# EAGLE design untitled (EAGLE 9.6.2)
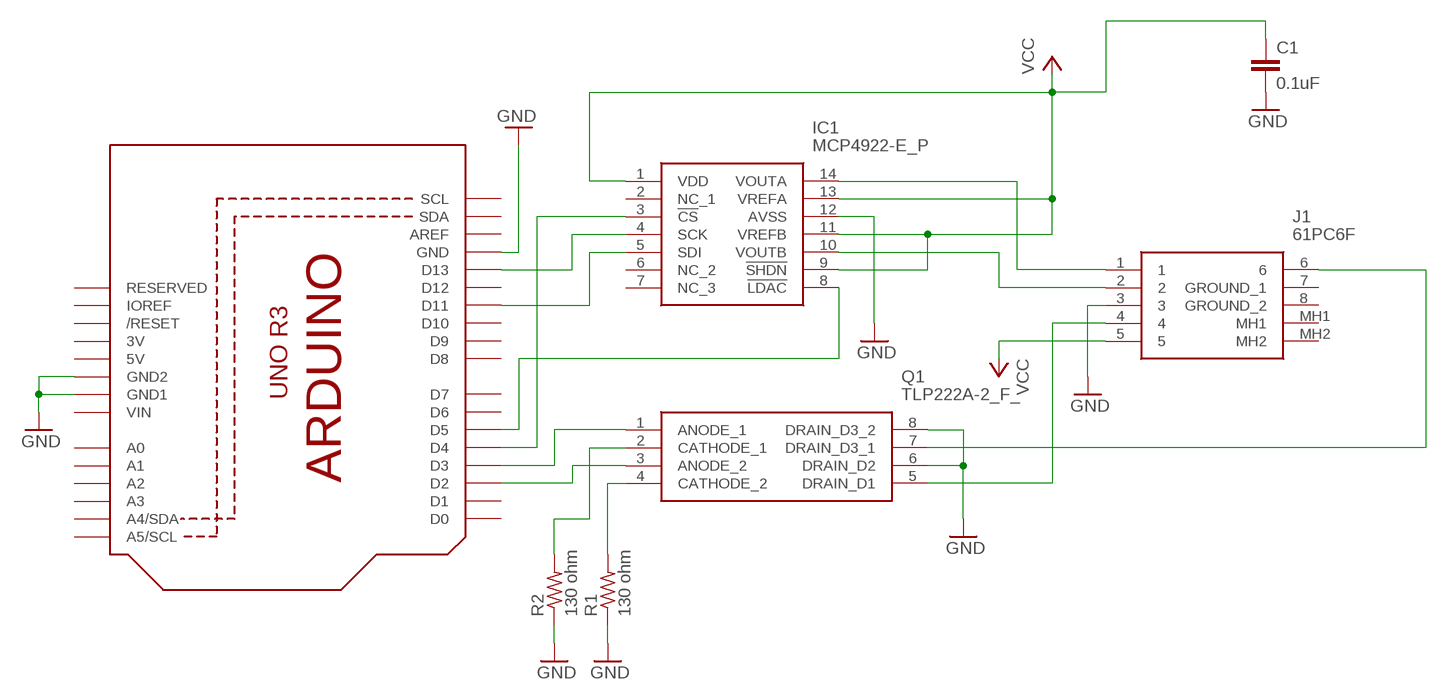
[diagram p0: schematic, sheet 1]

## Parts
C1  0.1uF  C-EU050-024X044  [C050-024X044]
IC1  MCP4922-E_P  [DIP794W56P254L1905H432Q14N]
J1  61PC6F  [61PC6F]
Q1  TLP222A-2_F_  [DIP762W60P254L966H485Q8N]
R1  130 ohm  R-US_0207/7  [0207/7]
R2  130 ohm  R-US_0207/7  [0207/7]
U1  ARDUINOR3-BPLACE  [ARDUINOR3-BPLACE]

## Nets
GND: C1.2 IC1.12(AVSS) J1.3 Q1.6(DRAIN_D2) Q1.8(DRAIN_D3_2) R1.1 R2.1 U1.GND U1.GND1 U1.GND2
N$1: IC1.4(SCK) U1.D13
N$2: IC1.5(SDI) U1.D11
N$3: Q1.4(CATHODE_2) R1.2
N$4: IC1.3(!CS) U1.D4
N$5: IC1.8(!LDAC) U1.D5
N$6: Q1.2(CATHODE_1) R2.2
N$7: Q1.1(ANODE_1) U1.D3
N$8: Q1.3(ANODE_2) U1.D2
N$10: J1.6 Q1.7(DRAIN_D3_1)
N$11: J1.4 Q1.5(DRAIN_D1)
N$12: IC1.14(VOUTA) J1.1
N$14: IC1.10(VOUTB) J1.2
VCC: C1.1 IC1.1(VDD) IC1.9(!SHDN) IC1.11(VREFB) IC1.13(VREFA) J1.5
Unconnected: IC1.2(NC_1) IC1.6(NC_2) IC1.7(NC_3) J1.7(GROUND_1) J1.8(GROUND_2) J1.MH1 J1.MH2 U1.A0 U1.A1 U1.A2 U1.A3 U1.A4(A4/SDA) U1.A5(A5/SCL) U1.AREF U1.D0 U1.D1 U1.D6 U1.D7 U1.D8 U1.D9 U1.D10 U1.D12 U1.IOREF U1.RESERVED U1.RESET(/RESET) U1.SCL U1.SDA

## Power pins joined to a net without a drawn wire
3V: U1.3V
5V: U1.5V
VIN: U1.VIN

## Library data of the parts
C1 = rcl:C-EU: CAPACITOR, European symbol; SPICEPREFIX: C
IC1 = SamacSys_Parts:MCP4922-E_P: Microchip MCP4922-E/P, 2-channel 12 bit Serial DAC, 14-Pin PDIP Source: Datasheet <https://componentsearchengine.com/Datasheets/1/MCP4922-E_P.pdf>; DESCRIPTION: Microchip MCP4922-E/P, 2-channel 12 bit Serial DAC, 14-Pin PDIP; HEIGHT: 4.32mm; MANUFACTURER_NAME: Microchip; MANUFACTURER_PART_NUMBER: MCP4922-E/P; MOUSER_PART_NUMBER: 579-MCP4922-E/P; MOUSER_PRICE-STOCK: https://www.mouser.com/Search/Refine.aspx?Keyword=579-MCP4922-E%2FP
J1 = SamacSys_Parts:61PC6F: Conn Circular DIN F 6 POS Solder RA Thru-Hole 6 Terminal 1 Port Source: Datasheet <https://componentsearchengine.com/Datasheets/1/61PC6F.pdf>; DESCRIPTION: Conn Circular DIN F 6 POS Solder RA Thru-Hole 6 Terminal 1 Port; HEIGHT: 21mm; MANUFACTURER_NAME: Switchcraft; MANUFACTURER_PART_NUMBER: 61PC6F; MOUSER_PART_NUMBER: 502-61PC6F; MOUSER_PRICE-STOCK: https://www.mouser.com/Search/Refine.aspx?Keyword=502-61PC6F
Q1 = SamacSys_Parts:TLP222A-2_F_: MOSFET Output Optocouplers Photorelay Voff=60V Ion=0.5/0.4A dual Source: Datasheet <https://componentsearchengine.com/Datasheets/1/TLP222A-2(F).pdf>; DESCRIPTION: MOSFET Output Optocouplers Photorelay Voff=60V Ion=0.5/0.4A dual; HEIGHT: 4.85mm; MANUFACTURER_NAME: Toshiba; MANUFACTURER_PART_NUMBER: TLP222A-2(F); MOUSER_PART_NUMBER: 757-TLP222A-2(F); MOUSER_PRICE-STOCK: https://www.mouser.com/Search/Refine.aspx?Keyword=757-TLP222A-2%28F%29
R1 R2 = adafruit:R-US_: RESISTOR, American symbol
U1 = adafruit:ARDUINOR3: This is a new object for the new Arduino R3 - with extra pins that you may want to use (such as IOref, and duplicated A4/A5

## Board
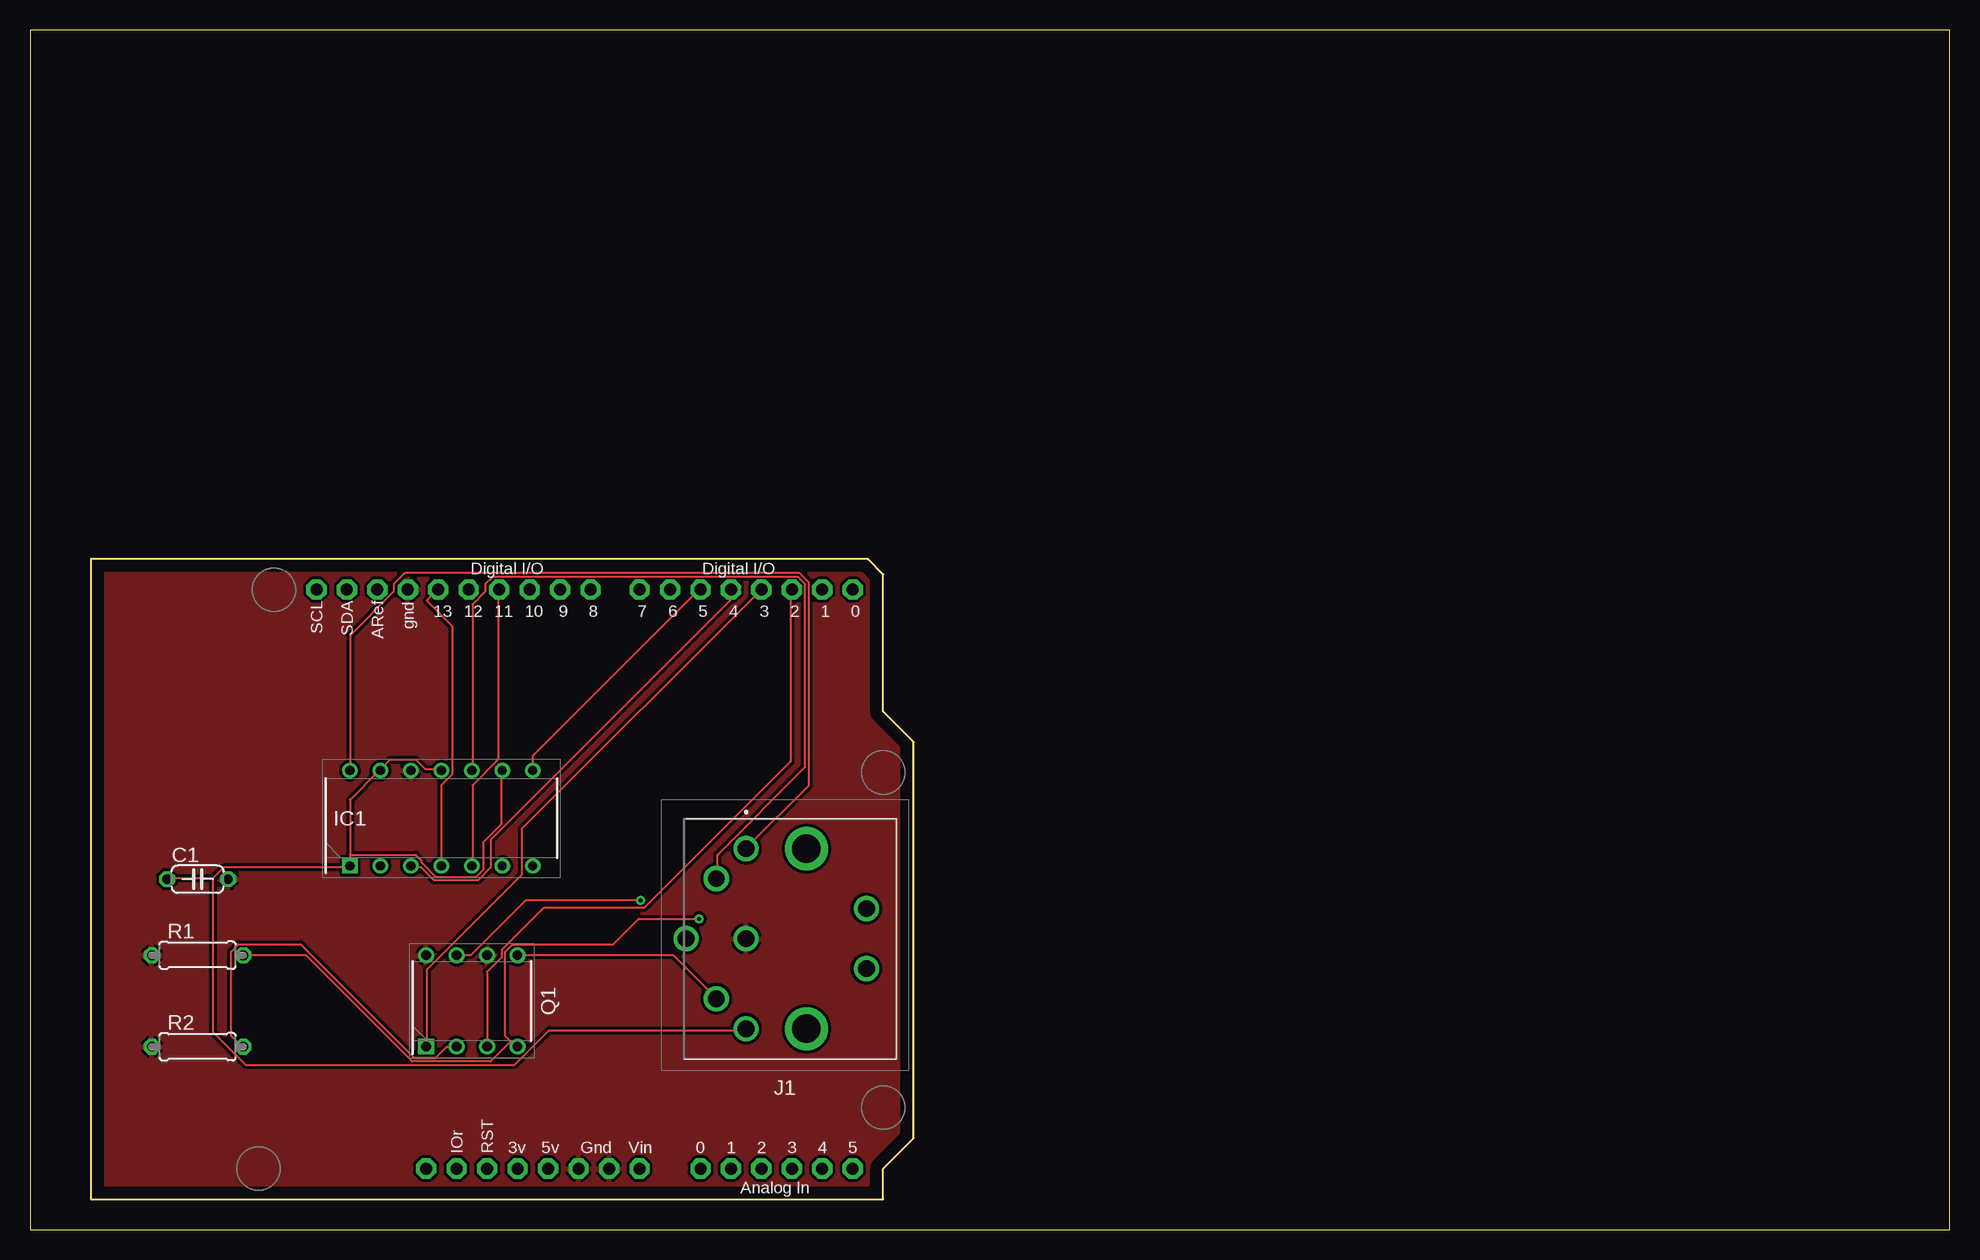
[diagram p1: board, top side]
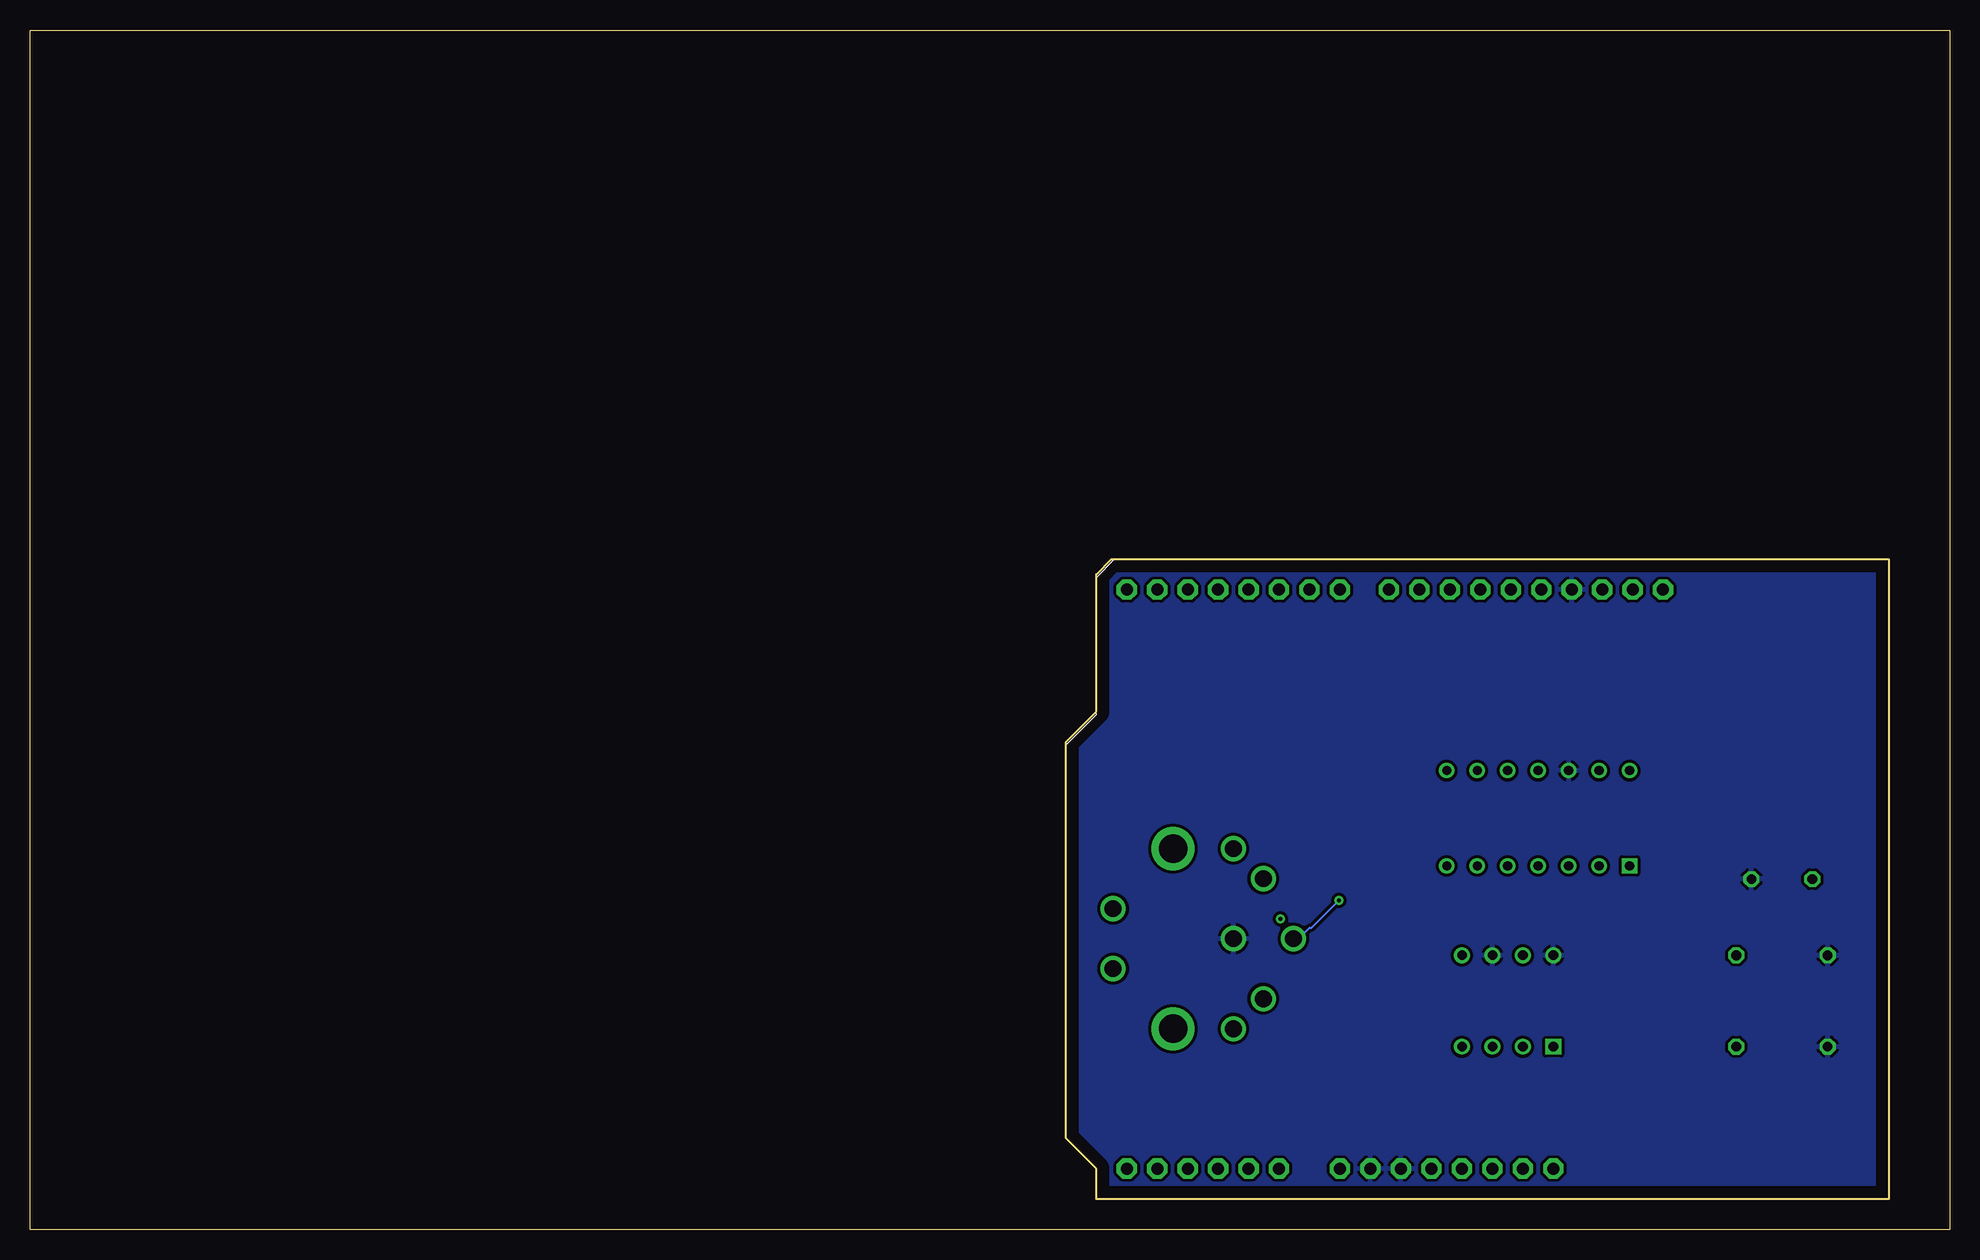
[diagram p2: board, bottom side, seen from below]

Size 160 x 100 mm. Coordinates in mm from the lower left corner, seen from the top.
Outline: 0,0 160,0 160,100 0,100 0,0
Outline: 5.08,55.88 5.08,2.54 71.12,2.54 71.12,5.08 73.66,7.62 73.66,40.64 71.12,43.18 71.12,54.61 69.85,55.88 5.08,55.88
Copper layers (1*16): Top 0.035mm / dielectric 1.5mm / Bottom 0.035mm
Design rules "default": minimum track width 6mil, minimum drill 0.35mm, track to track 6mil, track to pad 6mil, pad to pad 6mil, via to via 6mil, smd to smd 6mil, copper to edge 40mil, drill to drill 6mil, minimum pad ring 10mil, minimum via ring 8mil, stop-mask expansion 4mil, vias tented up to drill 0mil, thermal gap 10mil

### Footprints (pad centres in the part's own frame; a part is rotated, then mirrored left to right if it is on the bottom)
C050-024X044 = drill 0.813 octagon: 1 -2.54,0; 2 2.54,0
DIP794W56P254L1905H432Q14N = drill 0.76 pad 1.16 square: 1 -3.97,7.62 | drill 0.76 pad 1.16: 2 -3.97,5.08; 3 -3.97,2.54; 4 -3.97,0; 5 -3.97,-2.54; 6 -3.97,-5.08; 7 -3.97,-7.62; 8 3.97,-7.62; 9 3.97,-5.08; 10 3.97,-2.54; 11 3.97,0; 12 3.97,2.54; 13 3.97,5.08; 14 3.97,7.62
61PC6F = drill 1.4 pad 2.1: 1 0,0; 2 2.49,2.5; 3 0,7.505; 4 2.49,12.51; 5 0,15.01; 6 5,7.505; 7 -10.03,5.005; 8 -10.03,10.005 | drill 2.39 pad 3.585: MH1 -5.03,15.01; MH2 -5.03,0
DIP762W60P254L966H485Q8N = drill 0.8 pad 1.2 square: 1 -3.81,3.81 | drill 0.8 pad 1.2: 2 -3.81,1.27; 3 -3.81,-1.27; 4 -3.81,-3.81; 5 3.81,-3.81; 6 3.81,-1.27; 7 3.81,1.27; 8 3.81,3.81
0207/7 = drill 0.813 octagon: 1 -3.81,0; 2 3.81,0
ARDUINOR3-BPLACE = drill 1 pad 1.676 octagon: 3V 35.56,2.54; 5V 38.1,2.54; A0 50.8,2.54; A1 53.34,2.54; A2 55.88,2.54; A3 58.42,2.54; A4 60.96,2.54; A5 63.5,2.54; AREF 23.876,50.8; D0 63.5,50.8; D1 60.96,50.8; D2 58.42,50.8; D3 55.88,50.8; D4 53.34,50.8; D5 50.8,50.8; D6 48.26,50.8; D7 45.72,50.8; D8 41.656,50.8; D9 39.116,50.8; D10 36.576,50.8; D11 34.036,50.8; D12 31.496,50.8; D13 28.956,50.8; GND 26.416,50.8; GND1 43.18,2.54; GND2 40.64,2.54; IOREF 30.48,2.54; RESERVED 27.94,2.54; RESET 33.02,2.54; SCL 18.796,50.8; SDA 21.336,50.8; VIN 45.72,2.54

### Placement (x,y rotation side)
C1  13.97,29.21 0 top
IC1  34.29,34.29 90 top
J1  59.69,31.75 180 top
Q1  36.83,19.05 90 top
R1  13.97,22.86 0 top
R2  13.97,15.24 0 top
U1  5.08,2.54 0 top

### Tracks (layer width: path | path; a pad name or v marks a point on that pad's centre or on a via)
GND
  Top 0.152: 31.7,53.19 31.55,53.34 U1.GND | 45.72,5.18 U1.GND2
  Bottom 0.152: 16.41,29.11 C1.2
  pour Top (isolate 0.254): 5.08,55.88 69.85,55.88 71.12,54.61 71.12,43.18 73.66,40.64 73.66,7.62 71.12,5.08 71.12,2.54 5.08,2.54
  pour Bottom (isolate 0.254): 5.08,55.88 69.85,55.88 71.12,54.61 71.12,43.18 73.66,40.64 73.66,7.62 71.12,5.08 71.12,2.54 5.08,2.54
N$1
  Top 0.152: U1.D13 33.98,53.34 33.07,52.43 35.2,50.29 35.2,37.95 34.29,37.03 IC1.4
N$2
  Top 0.152: 36.73,30.33 IC1.5 36.88,30.33 36.88,37.03 39.01,39.17 39.01,52.58 | 39.01,52.58 39.01,53.34 U1.D11 39.01,52.58
N$3  (via drill 0.35)
  Top 0.152: v55.78,25.91 50.75,25.91 48.62,23.77 40.23,23.77 39.62,23.16 39.62,16.15 40.08,15.7 | 40.08,15.7 40.54,15.24 Q1.4 | R1.2 23.01,22.86 31.85,14.02 38.41,14.02 40.08,15.7
N$4
  Top 0.152: IC1.3 31.85,30.18 32.61,30.18 33.68,29.11 37.34,29.11 38.41,30.18 38.41,32.46 58.37,52.43 58.37,53.34 U1.D4
  Bottom 0.152: 31.7,30.33 IC1.3 | 58.37,53.34 U1.D4
N$5
  Top 0.152: IC1.8 41.91,39.47 55.78,53.34 U1.D5
N$6
  Top 0.152: Q1.2 34.75,15.24 33.83,14.33 32,14.33 22.55,23.77 17.37,23.77 16.76,23.16 16.76,16.15 17.68,15.24 R2.2
N$7
  Top 0.152: U1.D3 41,33.38 41,29.57 33.07,21.64 33.07,15.24 Q1.1
N$8
  Top 0.152: Q1.3 38.1,21.49 39.32,22.71 39.32,23.32 42.82,26.82 51.21,26.82 63.4,39.01 63.4,53.34 U1.D2
  Bottom 0.152: 63.4,53.34 U1.D2
N$10  (via drill 0.35)
  Top 0.152: Q1.7 36.73,22.86 41.3,27.43 v50.9,27.43
  Bottom 0.152: v50.9,27.43 53.19,25.15 53.34,25.15 54.1,24.38 54.56,24.38 J1.6
N$11
  Top 0.152: Q1.5 53.65,22.86 57.15,19.36 J1.4
N$12
  Top 0.152: IC1.14 26.67,49.53 30.33,53.19 30.33,53.8 31.24,54.71 64.16,54.71 64.92,53.95 64.92,37.03 59.74,31.85 J1.1
  Bottom 0.152: 59.59,31.85 J1.1
N$14
  Top 0.152: 36.88,38.25 IC1.10 36.88,38.41 36.88,52.12 37.95,53.19 37.95,53.8 38.56,54.41 64.01,54.41 64.62,53.8 64.62,38.56 57.3,31.24 57.3,29.26 J1.2
VCC
  Top 0.152: 39.32,38.41 IC1.9 39.32,38.25 39.32,33.83 37.8,32.31 37.8,30.02 37.19,29.41 33.83,29.41 32.61,30.63 32.61,30.79 32.16,31.24 26.67,31.24 | 26.67,31.24 26.67,35.81 29.11,38.25 IC1.13 29.26,38.41 30.02,39.17 32.16,39.17 32.92,38.41 34.29,38.41 IC1.11 | 26.67,31.24 IC1.1 26.67,30.18 16.15,30.18 15.24,29.26 | 15.24,29.26 11.43,29.26 C1.1 | 15.24,29.26 15.24,16.46 17.98,13.72 40.39,13.72 43.28,16.61 59.59,16.61 J1.5
  Bottom 0.152: IC1.11